# EAGLE design RGB_1_1b (EAGLE 8.3.2)
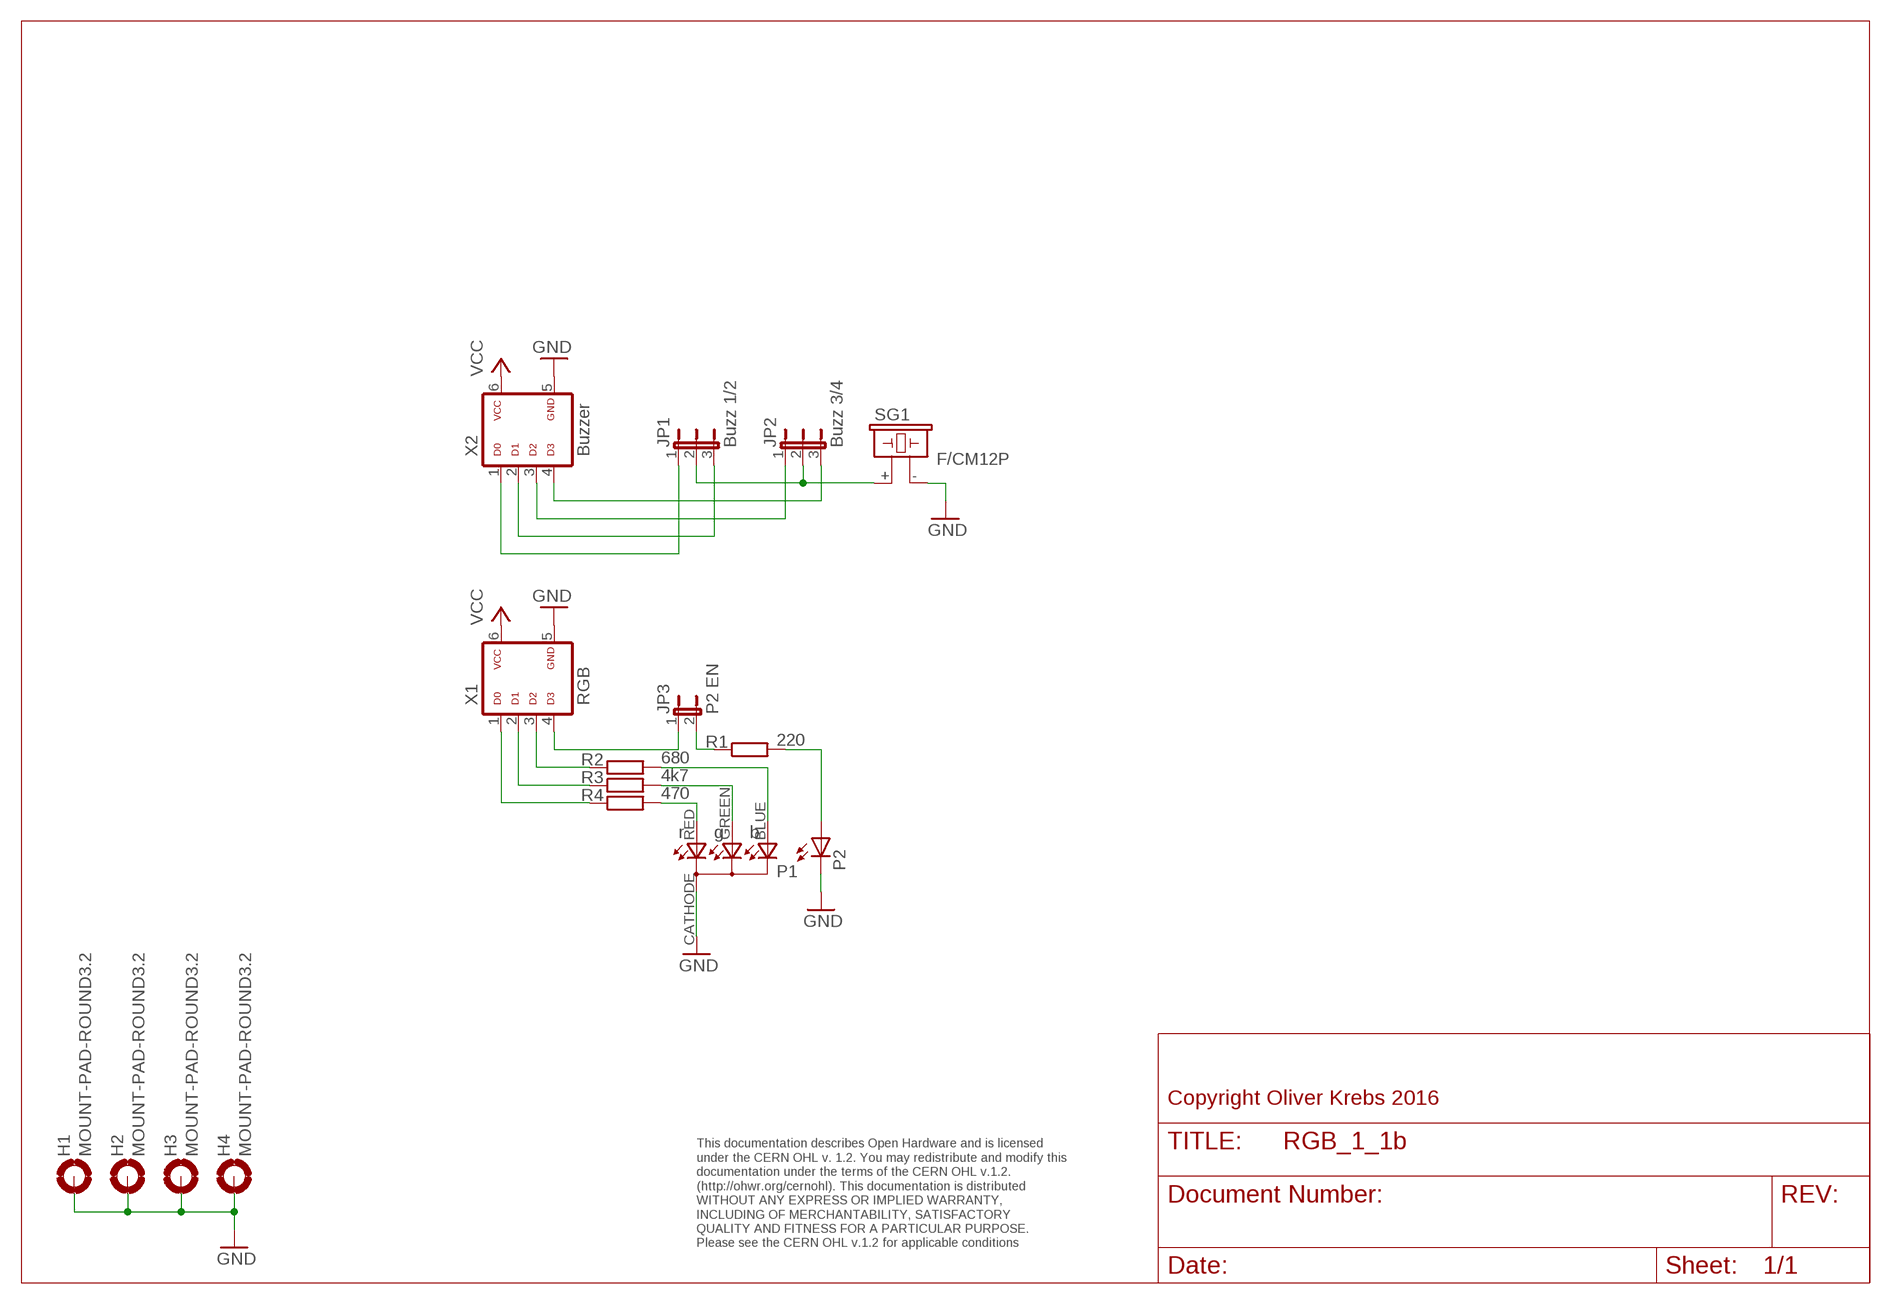
[diagram p0: schematic, sheet 1]

## Parts
H1  MOUNT-PAD-ROUND3.2  [3,2-PAD]
H2  MOUNT-PAD-ROUND3.2  [3,2-PAD]
H3  MOUNT-PAD-ROUND3.2  [3,2-PAD]
H4  MOUNT-PAD-ROUND3.2  [3,2-PAD]
JP1  Buzz 1/2  JP2E  [JP2]
JP2  Buzz 3/4  JP2E  [JP2]
JP3  P2 EN  JP1E  [JP1]
P1  RGB-5MM  [RGB5MM]
P2  LED5MM  [LED5MM]
R1  220  R-EU_0207/10  [0207/10]
R2  680  R-EU_0207/10  [0207/10]
R3  4k7  R-EU_0207/10  [0207/10]
R4  470  R-EU_0207/10  [0207/10]
SG1  F/CM12P  [F/CM12P]
X1  RGB  ML6D  [ML-6]
X2  Buzzer  ML6D  [ML-6]

## Nets
GND: H1.B3,2(MOUNT) H2.B3,2(MOUNT) H3.B3,2(MOUNT) H4.B3,2(MOUNT) P1.CATHODE P2.K(C) SG1.- X1.5 X2.5
N$1: JP1.2 JP2.2 SG1.+
N$2: JP3.1 X1.4
N$3: JP1.1 X2.1
N$4: JP1.3 X2.2
N$5: JP2.1 X2.3
N$6: JP2.3 X2.4
N$7: R2.1 X1.3
N$8: R4.1 X1.1
N$9: R3.1 X1.2
N$10: P1.RED(A-RED) R4.2
N$11: P1.GREEN(A-GREEN) R3.2
N$12: P1.BLUE(A-BLUE) R2.2
N$13: P2.A R1.2
N$14: JP3.2 R1.1
VCC: X1.6 X2.6

## Notes on the sheet
- Copyright Oliver Krebs 2016
- This documentation describes Open Hardware and is licensed 
  under the CERN OHL v. 1.2. You may redistribute and modify this 
  documentation under the terms of the CERN OHL v.1.2. 
  (http://ohwr.org/cernohl). This documentation is distributed
  WITHOUT ANY EXPRESS OR IMPLIED WARRANTY, 
  INCLUDING OF MERCHANTABILITY, SATISFACTORY 
  QUALITY AND FITNESS FOR A PARTICULAR PURPOSE. 
  Please see the CERN OHL v.1.2 for applicable conditions

## Library data of the parts
H1-H4 = holes:MOUNT-PAD-ROUND: MOUNTING PAD, round
JP1 JP2 = jumper:JP2E: JUMPER
JP3 = jumper:JP1E: JUMPER
P1 = 01-my-led:RGB-5MM
P2 = 01-my-led:LED: LED OSRAM: - CHIPLED LG R971, LG N971, LY N971, LG Q971, LY Q971, LO R971, LY R971 LH N974, LH R974 LS Q976, LO Q976, LY Q976 LO Q996 - Hyper CHIPLED LW Q18S LB Q993, LB Q99A, LB R99A - SideLED LS A670, LO A670, LY A670, LG A670, LP A670 LB A673, LV A673, LT A673, LW A673 LH A674 LY A675 LS A676, LA A676, LO A676, LY A676, LW A676 LS A679, LY A679, LG A679 - Hyper Micro SIDELED® LS Y876, LA Y876, LO Y876, LY Y876 LT Y87S - SmartLED LW L88C, LW L88S LB L89C, LB L89S, LG L890 LS L89K, LO L89K, LY L89K LS L896, LA L896, LO L896, LY L896 - TOPLED LS T670, LO T670, LY T670, LG T670, LP T670 LSG T670, LSP T670, LSY T670, LOP T670, LYG T670 LG T671, LOG T671, LSG T671 LB T673, LV T673, LT T673, LW T673 LH T674 LS T676, LA T676, LO T676, LY T676, LB T676, LH T676, LSB T676, LW T676 LB T67C, LV T67C, LT T67C, LS T67K, LO T67K, LY T67K, LW E67C LS E67B, LA E67B, LO E67B, LY E67B, LB E67C, LV E67C, LT E67C LW T67C LS T679, LY T679, LG T679 LS T770, LO T770, LY T770, LG T770, LP T770 LB T773, LV T773, LT T773, LW T773 LH T774 LS E675, LA E675, LY E675, LS T675 LS T776, LA T776, LO T776, LY T776, LB T776 LHGB T686 LT T68C, LB T68C - Hyper Mini TOPLED® LB M676 - Mini TOPLED Santana® LG M470 LS M47K, LO M47K, LY M47K Source: http://www.osram.convergy.de LUXEON: - LUMILED® LXK2-PW12-R00, LXK2-PW12-S00, LXK2-PW14-U00, LXK2-PW14-V00 LXK2-PM12-R00, LXK2-PM12-S00, LXK2-PM14-U00 LXK2-PE12-Q00, LXK2-PE12-R00, LXK2-PE12-S00, LXK2-PE14-T00, LXK2-PE14-U00 LXK2-PB12-K00, LXK2-PB12-L00, LXK2-PB12-M00, LXK2-PB14-N00, LXK2-PB14-P00, LXK2-PB14-Q00 LXK2-PR12-L00, LXK2-PR12-M00, LXK2-PR14-Q00, LXK2-PR14-R00 LXK2-PD12-Q00, LXK2-PD12-R00, LXK2-PD12-S00 LXK2-PH12-R00, LXK2-PH12-S00 LXK2-PL12-P00, LXK2-PL12-Q00, LXK2-PL12-R00 Source: www.luxeon.com KINGBRIGHT: KA-3528ASYC Source: www.kingbright.com
R1-R4 = 01-my_rcl:R-EU_: RESISTOR, European symbol
SG1 = buzzer:F/CM12P: BUZZER Source: Buerklin; OC_FARNELL: unknown; OC_NEWARK: unknown
X1 X2 = 01-my-con:ML6D

## Board
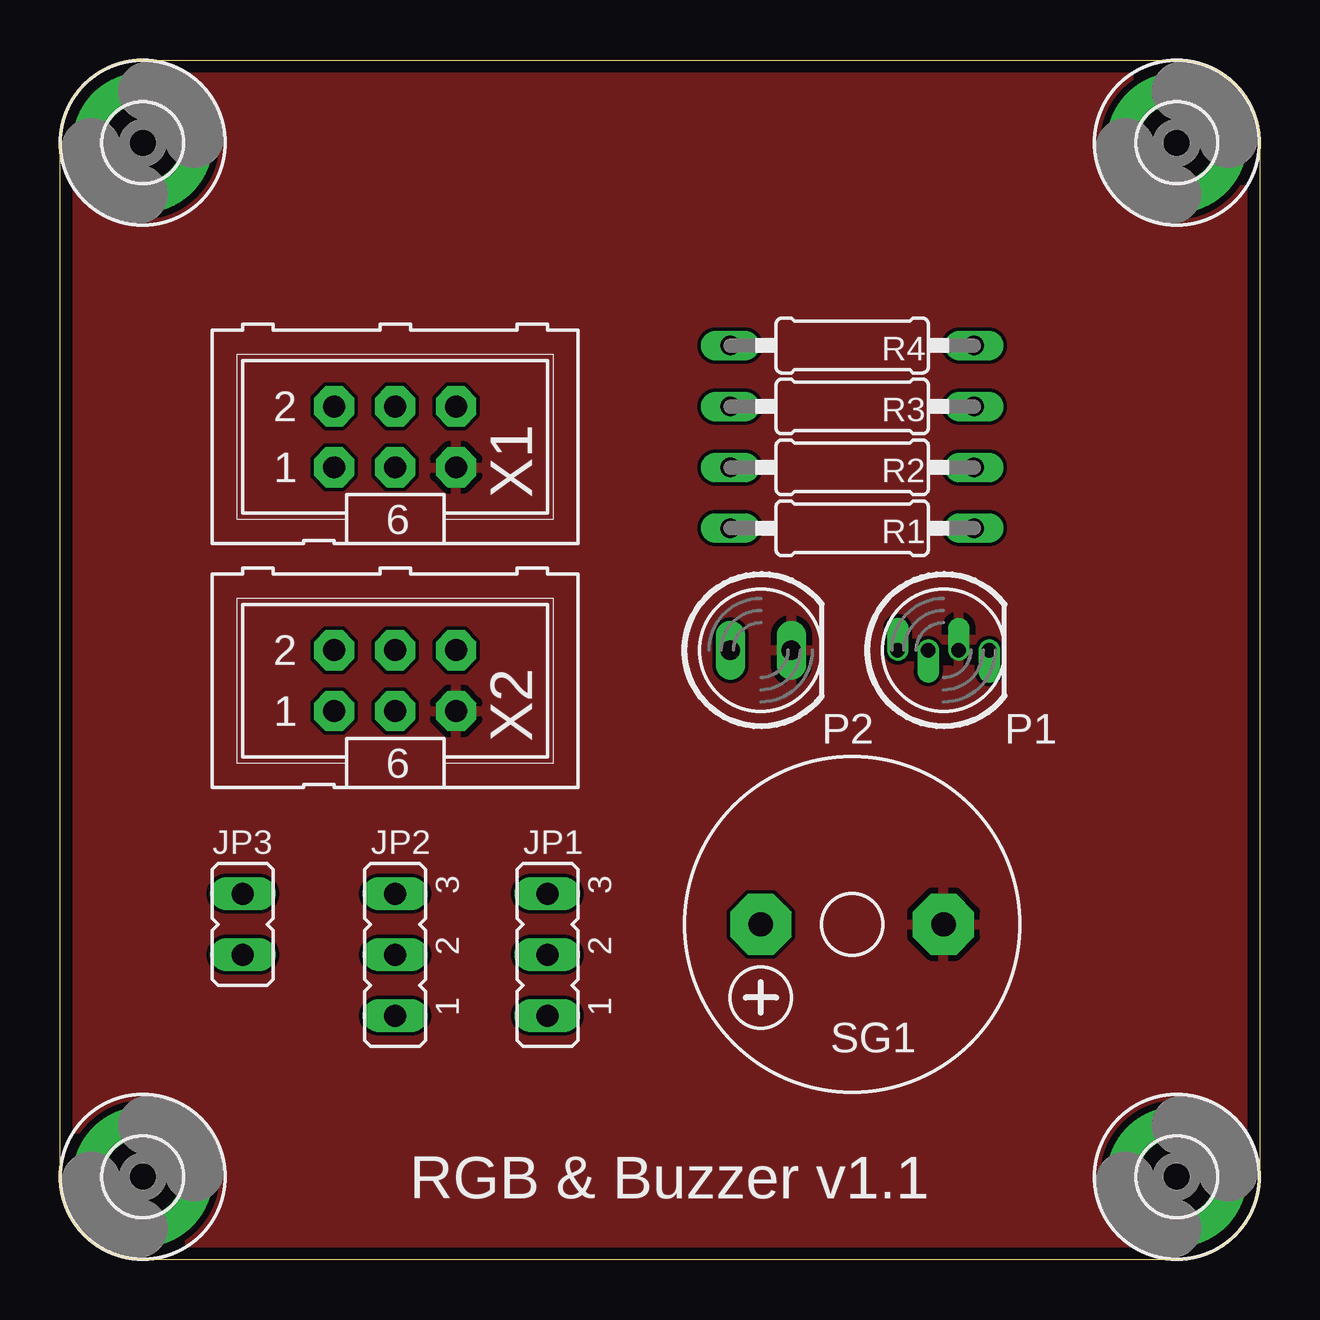
[diagram p1: board, top side]
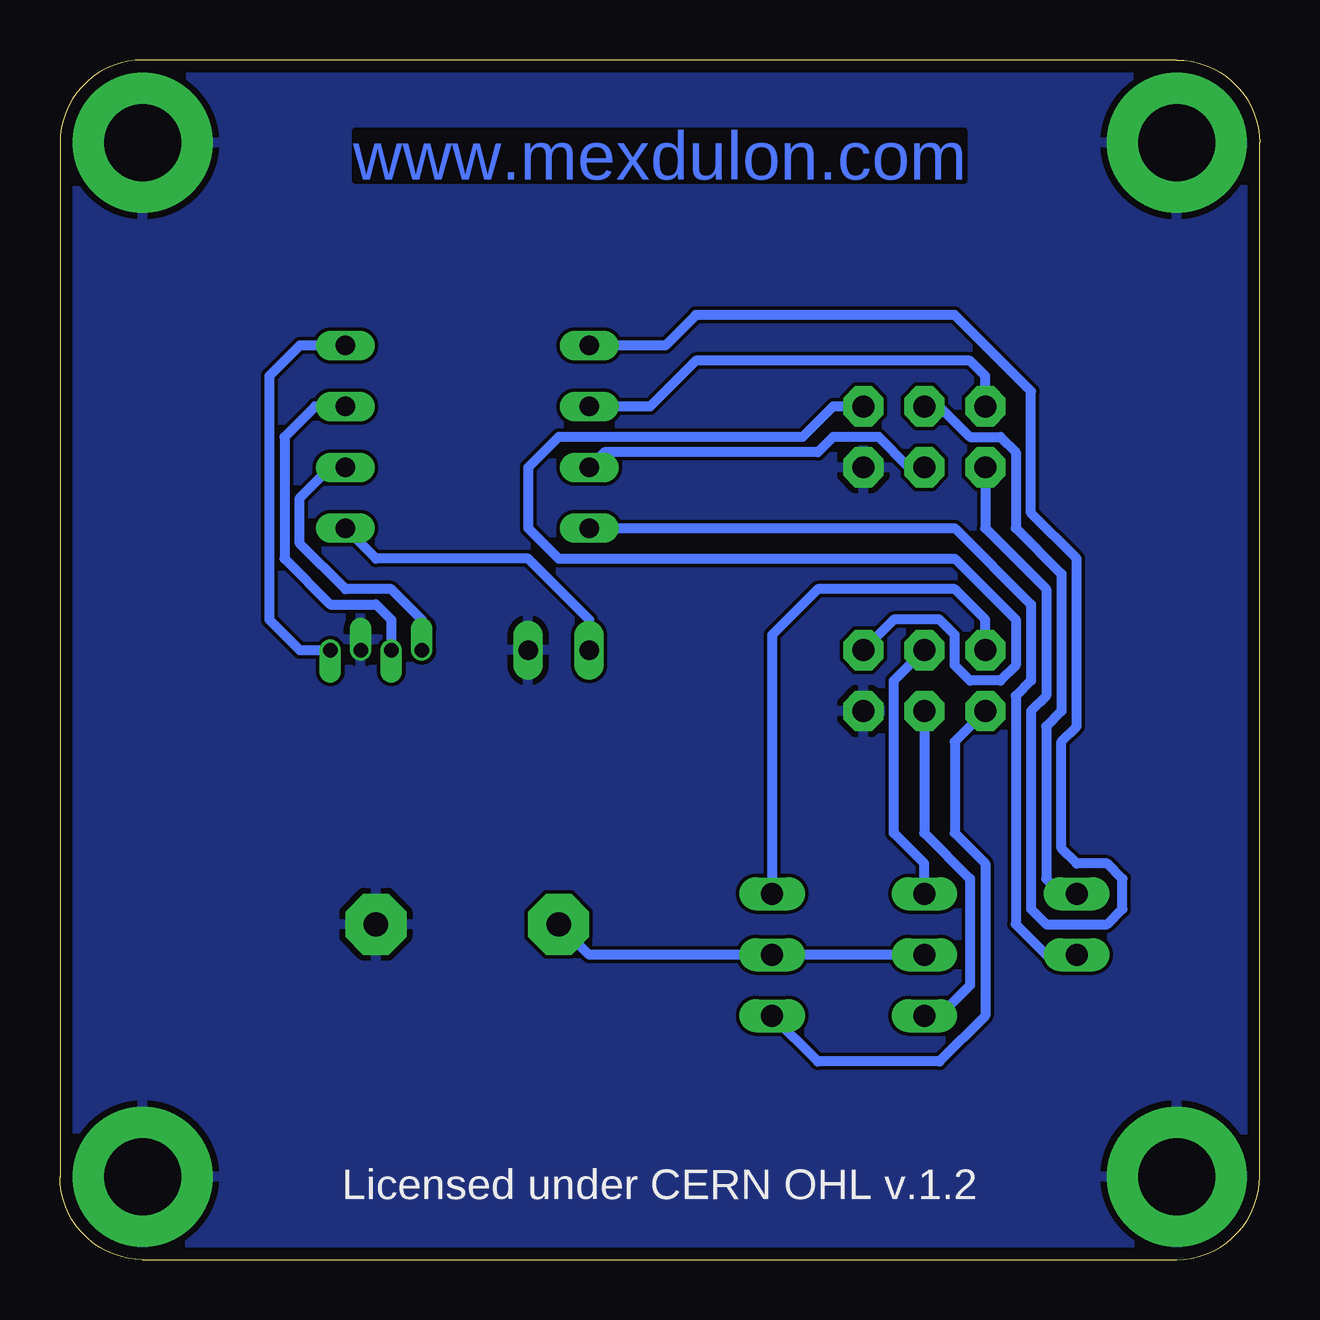
[diagram p2: board, bottom side, seen from below]

Size 50 x 50 mm. Coordinates in mm from the lower left corner, seen from the top.
Outline: 0,3.45 0,46.55 arc-90 3.45,50 46.55,50 arc-90 50,46.55 50,3.45 arc-90 46.55,0 3.45,0 arc-90 0,3.45
Copper layers (1*16): Top 0.035mm / dielectric 1.6mm / Bottom 0.035mm
Design rules "Elecrow_2-layer_PCB_eagle_rule": minimum track width 6mil, minimum drill 12mil, track to track 6mil, track to pad 6mil, pad to pad 6mil, via to via 8mil, smd to smd 0mil, copper to edge 20mil, drill to drill 10mil, minimum pad ring 6mil, minimum via ring 6mil, stop-mask expansion 0mil, vias tented up to drill 100mil, thermal gap 10mil

### Footprints (pad centres in the part's own frame; a part is rotated, then mirrored left to right if it is on the bottom)
3,2-PAD = drill 3.2 pad 5.842: B3,2 0,0
JP2 = drill 0.914 long: 1 -2.54,0; 2 0,0; 3 2.54,0
JP1 = drill 0.914 long: 1 0,-1.27; 2 0,1.27
RGB5MM = drill 0.6 offset: BLUE -1.905,0; CATHODE 0.635,0; GREEN -0.635,0; RED 1.905,0
LED5MM = drill 0.813 long: A -1.27,0; K 1.27,0
0207/10 = drill 0.813 long: 1 -5.08,0; 2 5.08,0
F/CM12P = drill 1.016 pad 2.54 octagon: + 3.81,0; - -3.81,0
ML-6 = drill 0.914 pad 1.676 octagon: 1 -2.54,-1.27; 2 -2.54,1.27; 3 0,-1.27; 4 0,1.27; 5 2.54,-1.27; 6 2.54,1.27

### Placement (x,y rotation side)
H1  3.45,3.45 0 top
H2  3.45,46.55 0 top
H3  46.55,46.55 0 top
H4  46.55,3.45 0 top
JP1  20.32,12.7 90 top
JP2  13.97,12.7 90 top
JP3  7.62,13.97 180 top
P1  36.83,25.4 0 top
P2  29.21,25.4 0 top
R1  33.02,30.48 0 top
R2  33.02,33.02 0 top
R3  33.02,35.56 0 top
R4  33.02,38.1 0 top
SG1  33.02,13.97 180 top
X1  13.97,34.29 0 top
X2  13.97,24.13 0 top

### Tracks (layer width: path | path; a pad name or v marks a point on that pad's centre or on a via)
GND
  pour Bottom: -0.17,0 -0.17,50.16 50,50.16 50,0
  pour Top: -0.17,0 -0.17,50.16 50,50.16 50,0
N$1
  Bottom 0.406: JP2.2 JP1.2 27.94,12.7 SG1.+
N$2
  Bottom 0.406: X1.4 13.34,35.56 12.06,34.29 10.79,34.29 10.16,33.66 10.16,30.48 8.26,28.57 8.26,22.86 8.89,22.23 8.89,15.88 8.26,15.24 JP3.1
N$3
  Bottom 0.406: X2.1 12.7,21.59 12.7,17.78 11.43,16.51 11.43,10.16 13.34,8.26 18.41,8.26 JP1.1
N$4
  Bottom 0.406: X2.2 11.43,26.67 12.7,27.94 18.41,27.94 20.32,26.04 JP1.3
N$5
  Bottom 0.406: X2.3 13.97,17.78 12.06,15.88 12.06,11.43 13.34,10.16 JP2.1
N$6
  Bottom 0.406: X2.4 15.24,24.13 15.24,17.78 13.97,16.51 JP2.3
N$7
  Bottom 0.406: X1.3 14.61,33.02 15.88,34.29 17.78,34.29 18.41,33.66 27.3,33.66 R2.1
N$8
  Bottom 0.406: X1.1 11.43,30.48 8.89,27.94 8.89,23.5 9.53,22.86 9.53,14.61 8.89,13.97 6.35,13.97 5.71,14.61 5.71,15.88 6.35,16.51 7.62,16.51 8.26,17.14 8.26,21.59 7.62,22.23 7.62,29.21 9.53,31.11 9.53,36.2 12.7,39.37 23.5,39.37 24.77,38.1 R4.1
N$9
  Bottom 0.406: X1.2 11.43,36.83 12.06,37.47 23.5,37.47 25.4,35.56 R3.1
N$10
  Bottom 0.406: R4.2 40.01,38.1 41.27,36.83 41.27,26.67 40.01,25.4 P1.RED
N$11
  Bottom 0.406: R3.2 39.37,35.56 40.64,34.29 40.64,29.21 38.73,27.3 36.83,27.3 36.2,26.67 P1.GREEN
N$12
  Bottom 0.406: P1.BLUE 34.92,26.67 36.2,27.94 38.1,27.94 40.01,29.84 40.01,31.75 38.73,33.02 R2.2
N$13
  Bottom 0.406: P2.A 27.94,26.67 30.48,29.21 36.83,29.21 R1.2
N$14
  Bottom 0.406: R1.1 12.7,30.48 9.53,27.3 9.53,24.13 10.16,23.5 10.16,13.97 8.89,12.7 JP3.2
VCC
  Bottom 0.406: X1.6 17.78,35.56 19.05,34.29 29.21,34.29 30.48,33.02 30.48,30.48 29.21,29.21 12.7,29.21 10.16,26.67 10.16,24.77 10.79,24.13 12.06,24.13 12.7,24.77 12.7,26.04 13.34,26.67 15.24,26.67 X2.6

### Text on the board
Bottom: www.mexdulon.com
tNames: RGB & Buzzer v1.1
bNames: Licensed under CERN OHL v.1.2